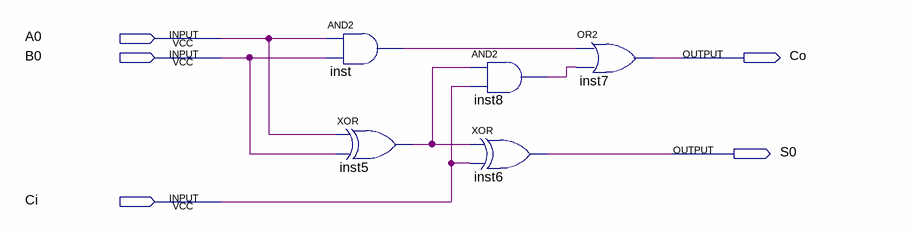
[diagram p0: schematic sheet]
// Quartus schematic Homework1_1BitAdder.bdf as structural Verilog: 5 symbols, 5 pins
module Homework1_1BitAdder (
  input  A0,
  input  B0,
  input  Ci,
  output Co,
  output S0
);

  wire inst5_out, inst8_out, inst_out;

  and inst (inst_out, A0, B0);
  xor inst5 (inst5_out, A0, B0);
  and inst8 (inst8_out, inst5_out, Ci);
  xor inst6 (S0, inst5_out, Ci);
  or inst7 (Co, inst_out, inst8_out);
endmodule
